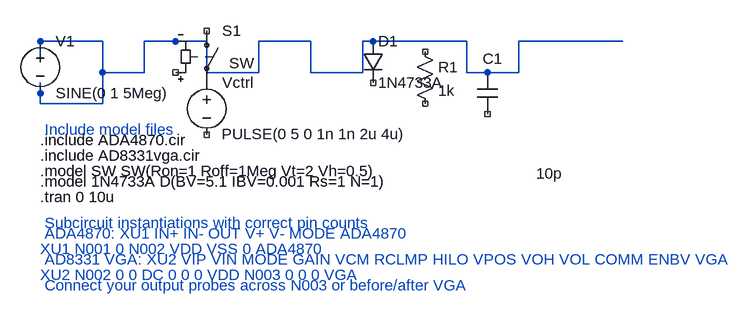
[diagram p0: schematic switching circuit.asc]
switching circuit.asc, the LTspice schematic file:
Version 4.1
SHEET 1 1152 884
WIRE 160 64 64 64
WIRE 272 64 224 64
WIRE 320 64 272 64
WIRE 480 64 400 64
WIRE 576 64 560 64
WIRE 720 64 576 64
WIRE 960 64 800 64
WIRE 64 96 64 64
WIRE 160 112 160 64
WIRE 224 112 224 64
WIRE 224 112 160 112
WIRE 320 112 320 64
WIRE 400 112 400 64
WIRE 400 112 320 112
WIRE 480 112 480 64
WIRE 560 112 560 64
WIRE 560 112 480 112
WIRE 720 112 720 64
WIRE 752 112 720 112
WIRE 800 112 800 64
WIRE 800 112 752 112
WIRE 64 144 64 128
WIRE 64 160 64 144
WIRE 160 160 160 112
WIRE 160 160 64 160
SYMBOL voltage 64 48 R0
SYMATTR InstName V1
SYMATTR Value SINE(0 1 5Meg)
SYMBOL sw 320 32 R0
WINDOW 3 35 66 Left 2
SYMATTR InstName S1
SYMBOL diode 560 64 R0
SYMATTR InstName D1
SYMATTR Value 1N4733A
SYMBOL res 640 64 R0
SYMATTR InstName R1
SYMATTR Value 1k
SYMBOL cap 736 112 R0
WINDOW 0 9 -21 Left 2
WINDOW 3 91 156 Left 2
SYMATTR InstName C1
SYMATTR Value 10p
SYMBOL voltage 320 112 R0
WINDOW 3 23 95 Left 2
SYMATTR InstName Vctrl
SYMATTR Value PULSE(0 5 0 1n 1n 2u 4u)
TEXT 64 200 Left 2 ; Include model files
TEXT 64 216 Left 2 !.include ADA4870.cir
TEXT 64 240 Left 2 !.include AD8331vga.cir
TEXT 64 264 Left 2 !.model SW SW(Ron=1 Roff=1Meg Vt=2 Vh=0.5)
TEXT 64 280 Left 2 !.model 1N4733A D(BV=5.1 IBV=0.001 Rs=1 N=1)
TEXT 64 304 Left 2 !.tran 0 10u
TEXT 64 344 Left 2 ; Subcircuit instantiations with correct pin counts
TEXT 64 360 Left 2 ; ADA4870: XU1 IN+ IN- OUT V+ V- MODE ADA4870
TEXT 64 384 Left 2 ;XU1 N001 0 N002 VDD VSS 0 ADA4870
TEXT 64 400 Left 2 ; AD8331 VGA: XU2 VIP VIN MODE GAIN VCM RCLMP HILO VPOS VOH VOL COMM ENBV VGA
TEXT 64 424 Left 2 ;XU2 N002 0 0 DC 0 0 0 VDD N003 0 0 0 VGA
TEXT 64 440 Left 2 ; Connect your output probes across N003 or before/after VGA

The netlist it stands for:
* switching circuit.asc
V1 N001 N001 SINE(0 1 5Meg)
S1 NC_01 P001 NC_02 N001 SW
D1 N001 NC_03 1N4733A
R1 NC_04 NC_05 1k
C1 N001 NC_06 10p
Vctrl P001 NC_07 PULSE(0 5 0 1n 1n 2u 4u)
.model D D
.lib standard.dio
*  Include model files
.include ADA4870.cir
.include AD8331vga.cir
.model SW SW(Ron=1 Roff=1Meg Vt=2 Vh=0.5)
.model 1N4733A D(BV=5.1 IBV=0.001 Rs=1 N=1)
.tran 0 10u
*  Subcircuit instantiations with correct pin counts
*  ADA4870: XU1 IN+ IN- OUT V+ V- MODE ADA4870
* XU1 N001 0 N002 VDD VSS 0 ADA4870
*  AD8331 VGA: XU2 VIP VIN MODE GAIN VCM RCLMP HILO VPOS VOH VOL COMM ENBV VGA
* XU2 N002 0 0 DC 0 0 0 VDD N003 0 0 0 VGA
*  Connect your output probes across N003 or before/after VGA
.backanno
.end